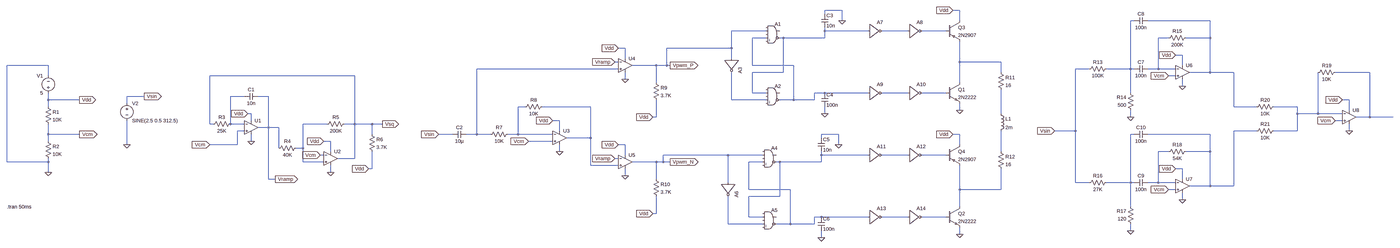
[diagram p0: schematic BANDPASS FILTER.asc, whole sheet]
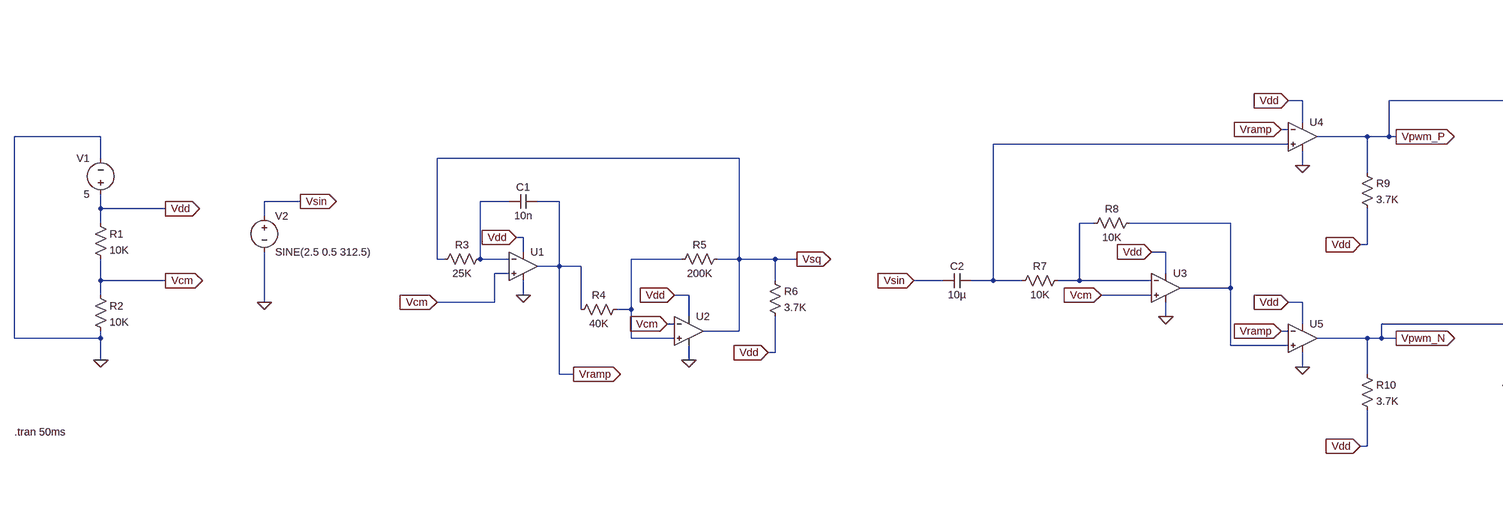
[diagram p1: schematic BANDPASS FILTER.asc, part, row 1 of 1, column 1 of 2]
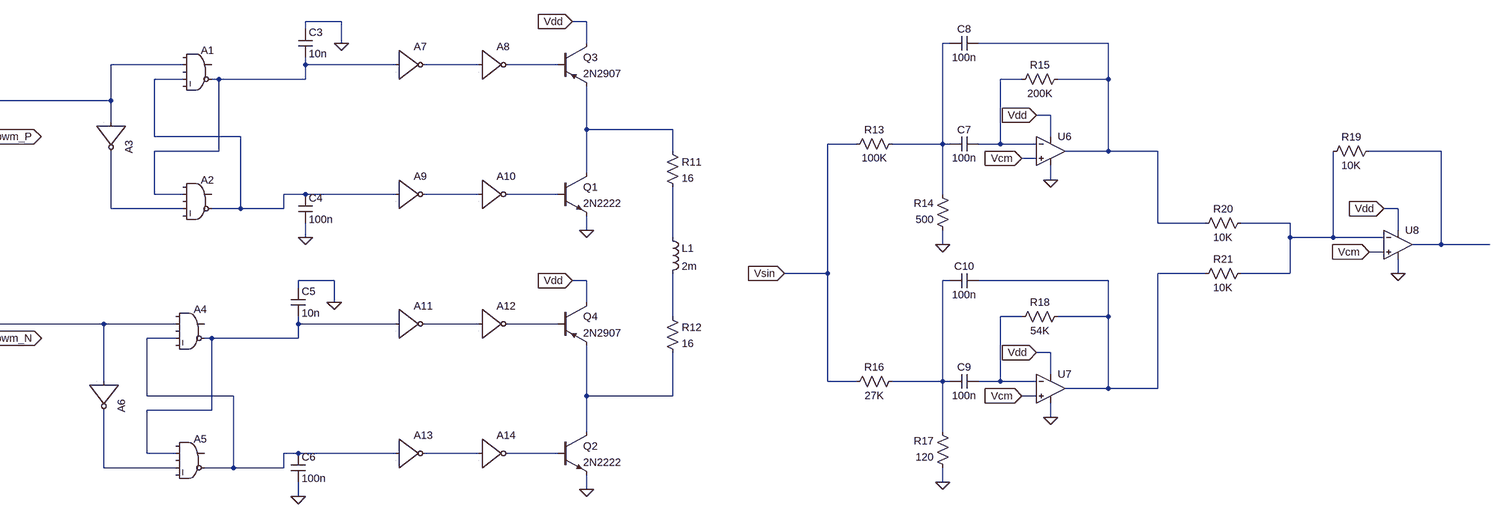
[diagram p2: schematic BANDPASS FILTER.asc, part, row 1 of 1, column 2 of 2]
BANDPASS FILTER.asc, the LTspice schematic file:
Version 4.1
SHEET 1 4436 680
WIRE 1072 -688 992 -688
WIRE 1824 -688 1792 -688
WIRE 992 -672 992 -688
WIRE 1072 -640 1072 -688
WIRE 1824 -640 1824 -688
WIRE 2960 -640 2944 -640
WIRE 3312 -640 3024 -640
WIRE 720 -592 560 -592
WIRE 992 -592 992 -608
WIRE 1296 -592 992 -592
WIRE 1584 -592 1360 -592
WIRE 1760 -592 1648 -592
WIRE 720 -560 656 -560
WIRE 800 -560 784 -560
WIRE 992 -560 992 -592
WIRE 992 -560 800 -560
WIRE 3120 -560 3072 -560
WIRE 3312 -560 3312 -640
WIRE 3312 -560 3200 -560
WIRE -96 -512 -128 -512
WIRE 560 -512 560 -592
WIRE 560 -512 96 -512
WIRE 3184 -480 3152 -480
WIRE -96 -464 -96 -512
WIRE 560 -464 560 -512
WIRE -128 -448 -144 -448
WIRE 1824 -448 1824 -544
WIRE 2112 -448 1824 -448
WIRE -2880 -432 -3072 -432
WIRE 48 -432 -64 -432
WIRE 96 -432 96 -512
WIRE 96 -432 48 -432
WIRE 112 -432 96 -432
WIRE 656 -432 656 -560
WIRE 848 -432 656 -432
WIRE 3184 -432 3184 -480
WIRE -128 -416 -784 -416
WIRE 2752 -416 2688 -416
WIRE 2944 -416 2944 -640
WIRE 2944 -416 2832 -416
WIRE 2960 -416 2944 -416
WIRE 3072 -416 3072 -560
WIRE 3072 -416 3024 -416
WIRE 3152 -416 3072 -416
WIRE 800 -400 800 -560
WIRE 800 -400 656 -400
WIRE 2112 -400 2112 -448
WIRE 3312 -400 3312 -560
WIRE 3312 -400 3216 -400
WIRE 3424 -400 3312 -400
WIRE 4224 -400 4064 -400
WIRE -2880 -384 -2880 -432
WIRE -1392 -384 -2064 -384
WIRE 3152 -384 3120 -384
WIRE -96 -368 -96 -400
WIRE 48 -352 48 -432
WIRE 1824 -352 1824 -448
WIRE 3184 -336 3184 -368
WIRE 656 -304 656 -400
WIRE 720 -304 656 -304
WIRE 992 -304 944 -304
WIRE 1296 -304 992 -304
WIRE 1584 -304 1360 -304
WIRE 1760 -304 1648 -304
WIRE 2944 -304 2944 -416
WIRE -2368 -288 -2448 -288
WIRE -1904 -288 -1968 -288
WIRE -1792 -288 -1840 -288
WIRE -2880 -272 -2880 -304
WIRE -2736 -272 -2880 -272
WIRE 560 -272 560 -400
WIRE 720 -272 560 -272
WIRE 848 -272 848 -432
WIRE 848 -272 784 -272
WIRE 944 -272 944 -304
WIRE 944 -272 848 -272
WIRE 4128 -272 4096 -272
WIRE -2448 -256 -2448 -288
WIRE -2880 -240 -2880 -272
WIRE -560 -240 -592 -240
WIRE -256 -240 -480 -240
WIRE 3424 -240 3424 -400
WIRE 3664 -240 3424 -240
WIRE 3888 -240 3744 -240
WIRE 1824 -224 1824 -256
WIRE 4128 -224 4128 -272
WIRE -1872 -208 -1888 -208
WIRE 992 -208 992 -240
WIRE 2112 -208 2112 -320
WIRE 3888 -208 3888 -240
WIRE 3984 -208 3984 -400
WIRE 3984 -208 3888 -208
WIRE 4096 -208 3984 -208
WIRE 48 -192 48 -272
WIRE 48 -192 32 -192
WIRE 2944 -192 2944 -224
WIRE 4224 -192 4224 -400
WIRE 4224 -192 4160 -192
WIRE 4432 -192 4224 -192
WIRE -1872 -176 -1872 -208
WIRE -400 -176 -432 -176
WIRE 4096 -176 4064 -176
WIRE -2064 -160 -2064 -384
WIRE -2048 -160 -2064 -160
WIRE -1968 -160 -1968 -288
WIRE -1904 -160 -1968 -160
WIRE -1520 -160 -1632 -160
WIRE -1392 -160 -1392 -384
WIRE -1392 -160 -1440 -160
WIRE -1312 -160 -1392 -160
WIRE -1264 -160 -1312 -160
WIRE -1792 -144 -1792 -288
WIRE -1792 -144 -1840 -144
WIRE -1744 -144 -1792 -144
WIRE -1904 -128 -1936 -128
WIRE -400 -128 -400 -176
WIRE 2688 -128 2688 -416
WIRE 2688 -128 2592 -128
WIRE 3664 -128 3424 -128
WIRE 3888 -128 3888 -208
WIRE 3888 -128 3744 -128
WIRE 4128 -128 4128 -160
WIRE -2880 -112 -2880 -160
WIRE -2736 -112 -2880 -112
WIRE -1312 -112 -1312 -160
WIRE -896 -112 -960 -112
WIRE -784 -112 -784 -416
WIRE -784 -112 -832 -112
WIRE -720 -112 -784 -112
WIRE -592 -112 -592 -240
WIRE -592 -112 -640 -112
WIRE -432 -112 -592 -112
WIRE 1056 -112 976 -112
WIRE 1824 -112 1792 -112
WIRE 2960 -112 2944 -112
WIRE 3312 -112 3024 -112
WIRE -256 -96 -256 -240
WIRE -256 -96 -368 -96
WIRE 976 -96 976 -112
WIRE -2880 -80 -2880 -112
WIRE -1872 -80 -1872 -112
WIRE -1504 -80 -1536 -80
WIRE -432 -80 -544 -80
WIRE -2448 -64 -2448 -176
WIRE -1936 -64 -1936 -128
WIRE -1936 -64 -2064 -64
WIRE -96 -64 -128 -64
WIRE 1056 -64 1056 -112
WIRE 1824 -64 1824 -112
WIRE -1744 -48 -1744 -144
WIRE -1632 -48 -1632 -160
WIRE -1632 -48 -1664 -48
WIRE -1504 -32 -1504 -80
WIRE -400 -32 -400 -64
WIRE 2112 -32 2112 -128
WIRE 3120 -32 3072 -32
WIRE 3312 -32 3312 -112
WIRE 3312 -32 3200 -32
WIRE -1536 -16 -1552 -16
WIRE -96 -16 -96 -64
WIRE 544 -16 80 -16
WIRE 704 -16 544 -16
WIRE 976 -16 976 -32
WIRE 1296 -16 976 -16
WIRE 1584 -16 1360 -16
WIRE 1760 -16 1648 -16
WIRE -1392 0 -1392 -160
WIRE -1392 0 -1472 0
WIRE -128 0 -144 0
WIRE -3072 16 -3072 -432
WIRE -2880 16 -2880 0
WIRE -2880 16 -3072 16
WIRE -1632 16 -1632 -48
WIRE -1536 16 -1632 16
WIRE 48 16 -64 16
WIRE 80 16 80 -16
WIRE 80 16 48 16
WIRE 112 16 80 16
WIRE 704 16 640 16
WIRE 784 16 768 16
WIRE 976 16 976 -16
WIRE 976 16 784 16
WIRE -256 32 -256 -96
WIRE -128 32 -256 32
WIRE -1312 48 -1312 -32
WIRE -1312 48 -1328 48
WIRE 3184 48 3152 48
WIRE -2880 64 -2880 16
WIRE -1504 64 -1504 32
WIRE -96 80 -96 48
WIRE -1792 96 -1792 -144
WIRE -1760 96 -1792 96
WIRE 48 96 48 16
WIRE 3184 96 3184 48
WIRE 544 112 544 -16
WIRE 2688 112 2688 -128
WIRE 2752 112 2688 112
WIRE 2944 112 2944 -112
WIRE 2944 112 2832 112
WIRE 2960 112 2944 112
WIRE 3072 112 3072 -32
WIRE 3072 112 3024 112
WIRE 3152 112 3072 112
WIRE 3312 128 3312 -32
WIRE 3312 128 3216 128
WIRE 3424 128 3424 -128
WIRE 3424 128 3312 128
WIRE 640 144 640 16
WIRE 832 144 640 144
WIRE 1824 144 1824 32
WIRE 2112 144 2112 48
WIRE 2112 144 1824 144
WIRE 3152 144 3120 144
WIRE 784 176 784 16
WIRE 784 176 640 176
WIRE 3184 192 3184 160
WIRE 1824 224 1824 144
WIRE 2944 224 2944 112
WIRE 48 256 48 176
WIRE 48 256 32 256
WIRE 640 272 640 176
WIRE 704 272 640 272
WIRE 976 272 944 272
WIRE 1296 272 976 272
WIRE 1584 272 1360 272
WIRE 1760 272 1648 272
WIRE 544 304 544 176
WIRE 704 304 544 304
WIRE 832 304 832 144
WIRE 832 304 768 304
WIRE 944 304 944 272
WIRE 944 304 832 304
WIRE 2944 336 2944 304
WIRE 1824 352 1824 320
WIRE 976 368 976 336
FLAG -2880 64 0
FLAG -2736 -112 Vcm
IOPIN -2736 -112 Out
FLAG -2736 -272 Vdd
IOPIN -2736 -272 Out
FLAG -2064 -64 Vcm
IOPIN -2064 -64 In
FLAG -1888 -208 Vdd
IOPIN -1888 -208 In
FLAG -1536 -80 Vdd
IOPIN -1536 -80 In
FLAG -1872 -80 0
FLAG -1504 64 0
FLAG -1552 -16 Vcm
IOPIN -1552 -16 In
FLAG -1760 96 Vramp
IOPIN -1760 96 Out
FLAG -1264 -160 Vsq
IOPIN -1264 -160 Out
FLAG -1328 48 Vdd
IOPIN -1328 48 In
FLAG -432 -176 Vdd
IOPIN -432 -176 In
FLAG -400 -32 0
FLAG -544 -80 Vcm
IOPIN -544 -80 In
FLAG -960 -112 Vsin
IOPIN -960 -112 In
FLAG -2448 -64 0
FLAG -2368 -288 Vsin
IOPIN -2368 -288 Out
FLAG -128 -512 Vdd
IOPIN -128 -512 In
FLAG -96 -368 0
FLAG -144 -448 Vramp
IOPIN -144 -448 In
FLAG -128 -64 Vdd
IOPIN -128 -64 In
FLAG -96 80 0
FLAG -144 0 Vramp
IOPIN -144 0 In
FLAG 112 -432 Vpwm_P
IOPIN 112 -432 Out
FLAG 112 16 Vpwm_N
IOPIN 112 16 Out
FLAG 32 -192 Vdd
IOPIN 32 -192 In
FLAG 32 256 Vdd
IOPIN 32 256 In
FLAG 1072 -640 0
FLAG 992 -208 0
FLAG 1056 -64 0
FLAG 976 368 0
FLAG 1824 -224 0
FLAG 1824 352 0
FLAG 1792 -688 Vdd
IOPIN 1792 -688 In
FLAG 1792 -112 Vdd
IOPIN 1792 -112 In
FLAG 3152 -480 Vdd
IOPIN 3152 -480 In
FLAG 3184 -336 0
FLAG 2944 -192 0
FLAG 3152 48 Vdd
IOPIN 3152 48 In
FLAG 3184 192 0
FLAG 2944 336 0
FLAG 4096 -272 Vdd
IOPIN 4096 -272 In
FLAG 4128 -128 0
FLAG 3120 -384 Vcm
IOPIN 3120 -384 In
FLAG 3120 144 Vcm
IOPIN 3120 144 In
FLAG 4064 -176 Vcm
IOPIN 4064 -176 In
FLAG 2592 -128 Vsin
IOPIN 2592 -128 In
SYMBOL res -2896 -256 R0
SYMATTR InstName R1
SYMATTR Value 10K
SYMBOL res -2896 -96 R0
SYMATTR InstName R2
SYMATTR Value 10K
SYMBOL OpAmps\\UniversalOpAmp1 -1872 -144 R0
SYMATTR InstName U1
SYMBOL res -1952 -176 R90
WINDOW 0 0 56 VBottom 2
WINDOW 3 32 56 VTop 2
SYMATTR InstName R3
SYMATTR Value 25K
SYMBOL voltage -2880 -288 R180
WINDOW 0 24 96 Left 2
WINDOW 3 24 16 Left 2
WINDOW 123 0 0 Left 0
WINDOW 39 0 0 Left 0
SYMATTR InstName V1
SYMATTR Value 5
SYMBOL OpAmps\\UniversalOpAmp2 -1504 0 R0
SYMATTR InstName U2
SYMBOL res -1648 -64 R90
WINDOW 0 0 56 VBottom 2
WINDOW 3 32 56 VTop 2
SYMATTR InstName R4
SYMATTR Value 40K
SYMBOL res -1424 -176 R90
WINDOW 0 0 56 VBottom 2
WINDOW 3 32 56 VTop 2
SYMATTR InstName R5
SYMATTR Value 200K
SYMBOL cap -1840 -304 R90
WINDOW 0 0 32 VBottom 2
WINDOW 3 32 32 VTop 2
SYMATTR InstName C1
SYMATTR Value 10n
SYMBOL res -1328 -128 R0
SYMATTR InstName R6
SYMATTR Value 3.7K
SYMBOL OpAmps\\UniversalOpAmp2 -400 -96 R0
SYMATTR InstName U3
SYMBOL res -624 -128 R90
WINDOW 0 0 56 VBottom 2
WINDOW 3 32 56 VTop 2
SYMATTR InstName R7
SYMATTR Value 10K
SYMBOL res -464 -256 R90
WINDOW 0 0 56 VBottom 2
WINDOW 3 32 56 VTop 2
SYMATTR InstName R8
SYMATTR Value 10K
SYMBOL cap -896 -128 M90
WINDOW 0 0 32 VBottom 2
WINDOW 3 32 32 VTop 2
SYMATTR InstName C2
SYMATTR Value 10µ
SYMATTR SpiceLine Irms=0
SYMBOL voltage -2448 -272 R0
WINDOW 123 0 0 Left 0
WINDOW 39 0 0 Left 0
SYMATTR InstName V2
SYMATTR Value SINE(2.5 0.5 312.5)
SYMBOL OpAmps\\UniversalOpAmp2 -96 -432 R0
SYMATTR InstName U4
SYMBOL OpAmps\\UniversalOpAmp2 -96 16 R0
SYMATTR InstName U5
SYMBOL res 32 -368 R0
SYMATTR InstName R9
SYMATTR Value 3.7K
SYMBOL res 32 80 R0
SYMATTR InstName R10
SYMATTR Value 3.7K
SYMBOL Digital\\and 752 -640 R0
SYMATTR InstName A1
SYMBOL Digital\\and 752 -352 R0
SYMATTR InstName A2
SYMBOL Digital\\inv 624 -464 R90
SYMATTR InstName A3
SYMBOL cap 976 -672 R0
SYMATTR InstName C3
SYMATTR Value 10n
SYMBOL cap 976 -304 R0
SYMATTR InstName C4
SYMATTR Value 100n
SYMBOL Digital\\and 736 -64 R0
SYMATTR InstName A4
SYMBOL Digital\\and 736 224 R0
SYMATTR InstName A5
SYMBOL Digital\\inv 608 112 R90
SYMATTR InstName A6
SYMBOL cap 960 -96 R0
SYMATTR InstName C5
SYMATTR Value 10n
SYMBOL cap 960 272 R0
SYMATTR InstName C6
SYMATTR Value 100n
SYMBOL Digital\\inv 1296 -656 R0
SYMATTR InstName A7
SYMBOL Digital\\inv 1584 -656 R0
SYMATTR InstName A8
SYMBOL Digital\\inv 1296 -368 R0
SYMATTR InstName A9
SYMBOL Digital\\inv 1584 -368 R0
SYMATTR InstName A10
SYMBOL npn 1760 -352 R0
SYMATTR InstName Q1
SYMATTR Value 2N2222
SYMBOL res 2096 -416 R0
SYMATTR InstName R11
SYMATTR Value 16
SYMBOL res 2096 -48 R0
SYMATTR InstName R12
SYMATTR Value 16
SYMBOL ind 2096 -224 R0
SYMATTR InstName L1
SYMATTR Value 2m
SYMATTR SpiceLine Rser=1m
SYMBOL Digital\\inv 1296 -80 R0
SYMATTR InstName A11
SYMBOL Digital\\inv 1584 -80 R0
SYMATTR InstName A12
SYMBOL Digital\\inv 1296 208 R0
SYMATTR InstName A13
SYMBOL Digital\\inv 1584 208 R0
SYMATTR InstName A14
SYMBOL npn 1760 224 R0
SYMATTR InstName Q2
SYMATTR Value 2N2222
SYMBOL pnp 1760 -640 R0
SYMATTR InstName Q3
SYMATTR Value 2N2907
SYMBOL pnp 1760 -64 R0
SYMATTR InstName Q4
SYMATTR Value 2N2907
SYMBOL OpAmps\\UniversalOpAmp2 3184 -400 R0
SYMATTR InstName U6
SYMBOL res 2848 -432 R90
WINDOW 0 0 56 VBottom 2
WINDOW 3 32 56 VTop 2
SYMATTR InstName R13
SYMATTR Value 100K
SYMBOL res 2960 -208 R180
WINDOW 0 36 76 Left 2
WINDOW 3 36 40 Left 2
SYMATTR InstName R14
SYMATTR Value 500
SYMBOL res 3104 -544 R270
WINDOW 0 32 56 VTop 2
WINDOW 3 0 56 VBottom 2
SYMATTR InstName R15
SYMATTR Value 200K
SYMBOL cap 3024 -432 R90
WINDOW 0 0 32 VBottom 2
WINDOW 3 32 32 VTop 2
SYMATTR InstName C7
SYMATTR Value 100n
SYMBOL cap 3024 -656 R90
WINDOW 0 0 32 VBottom 2
WINDOW 3 32 32 VTop 2
SYMATTR InstName C8
SYMATTR Value 100n
SYMBOL OpAmps\\UniversalOpAmp2 3184 128 R0
SYMATTR InstName U7
SYMBOL res 2848 96 R90
WINDOW 0 0 56 VBottom 2
WINDOW 3 32 56 VTop 2
SYMATTR InstName R16
SYMATTR Value 27K
SYMBOL res 2960 320 R180
WINDOW 0 36 76 Left 2
WINDOW 3 36 40 Left 2
SYMATTR InstName R17
SYMATTR Value 120
SYMBOL res 3104 -16 R270
WINDOW 0 32 56 VTop 2
WINDOW 3 0 56 VBottom 2
SYMATTR InstName R18
SYMATTR Value 54K
SYMBOL cap 3024 96 R90
WINDOW 0 0 32 VBottom 2
WINDOW 3 32 32 VTop 2
SYMATTR InstName C9
SYMATTR Value 100n
SYMBOL cap 3024 -128 R90
WINDOW 0 0 32 VBottom 2
WINDOW 3 32 32 VTop 2
SYMATTR InstName C10
SYMATTR Value 100n
SYMBOL OpAmps\\UniversalOpAmp2 4128 -192 R0
SYMATTR InstName U8
SYMBOL res 4080 -416 R90
WINDOW 0 0 56 VBottom 2
WINDOW 3 32 56 VTop 2
SYMATTR InstName R19
SYMATTR Value 10K
SYMBOL res 3760 -256 R90
WINDOW 0 0 56 VBottom 2
WINDOW 3 32 56 VTop 2
SYMATTR InstName R20
SYMATTR Value 10K
SYMBOL res 3760 -144 R90
WINDOW 0 0 56 VBottom 2
WINDOW 3 32 56 VTop 2
SYMATTR InstName R21
SYMATTR Value 10K
TEXT -3072 224 Left 2 !.tran 50ms

The netlist it stands for:
* BANDPASS FILTER.asc
R1 Vdd Vcm 10K
R2 Vcm 0 10K
X§U1 Vcm N013 Vdd 0 Vramp level1 Avol=1Meg GBW=10Meg Vos=0 En=0 Enk=0 In=0 Ink=0 Rin=500Meg  ; pins In+ In- V+ V- OUT
R3 N013 Vsq 25K
V1 Vdd 0 5
X§U2 N019 Vcm Vdd 0 Vsq level2 Avol=1Meg GBW=10Meg Slew=10Meg Ilimit=25m Rail=0 Vos=0 En=0 Enk=0 In=0 Ink=0 Rin=500Meg  ; pins In+ In- V+ V- OUT
R4 N019 Vramp 40K
R5 Vsq N019 200K
C1 Vramp N013 10n
R6 Vsq Vdd 3.7K
X§U3 Vcm N015 Vdd 0 N016 level2 Avol=1Meg GBW=10Meg Slew=10Meg Ilimit=25m Rail=0 Vos=0 En=0 Enk=0 In=0 Ink=0 Rin=500Meg  ; pins In+ In- V+ V- OUT
R7 N015 N009 10K
R8 N016 N015 10K
C2 Vsin N009 10µ Irms=0
V2 Vsin 0 SINE(2.5 0.5 312.5)
X§U4 N009 Vramp Vdd 0 Vpwm_P level2 Avol=1Meg GBW=10Meg Slew=10Meg Ilimit=25m Rail=0 Vos=0 En=0 Enk=0 In=0 Ink=0 Rin=500Meg  ; pins In+ In- V+ V- OUT
X§U5 N016 Vramp Vdd 0 Vpwm_N level2 Avol=1Meg GBW=10Meg Slew=10Meg Ilimit=25m Rail=0 Vos=0 En=0 Enk=0 In=0 Ink=0 Rin=500Meg  ; pins In+ In- V+ V- OUT
R9 Vpwm_P Vdd 3.7K
R10 Vpwm_N Vdd 3.7K
A1 0 Vpwm_P 0 N006 0 N003 0 0 AND
A2 0 N003 0 N014 0 N006 0 0 AND
A3 Vpwm_P 0 0 0 0 N014 0 0 BUF
C3 0 N003 10n
C4 N006 0 100n
A4 0 Vpwm_N 0 N027 0 N024 0 0 AND
A5 0 N024 0 N031 0 N027 0 0 AND
A6 Vpwm_N 0 0 0 0 N031 0 0 BUF
C5 0 N024 10n
C6 N027 0 100n
A7 N003 0 0 0 0 N004 0 0 BUF
A8 N004 0 0 0 0 N005 0 0 BUF
A9 N006 0 0 0 0 N011 0 0 BUF
A10 N011 0 0 0 0 N012 0 0 BUF
Q1 N008 N012 0 0 2N2222
R11 N008 N018 16
R12 N022 N028 16
L1 N018 N022 2m Rser=1m
A11 N024 0 0 0 0 N025 0 0 BUF
A12 N025 0 0 0 0 N026 0 0 BUF
A13 N027 0 0 0 0 N029 0 0 BUF
A14 N029 0 0 0 0 N030 0 0 BUF
Q2 N028 N030 0 0 2N2222
Q3 Vdd N005 N008 0 2N2907
Q4 Vdd N026 N028 0 2N2907
X§U6 Vcm N007 Vdd 0 N002 level2 Avol=1Meg GBW=10Meg Slew=10Meg Ilimit=25m Rail=0 Vos=0 En=0 Enk=0 In=0 Ink=0 Rin=500Meg  ; pins In+ In- V+ V- OUT
R13 N001 Vsin 100K
R14 0 N001 500
R15 N007 N002 200K
C7 N007 N001 100n
C8 N002 N001 100n
X§U7 Vcm N023 Vdd 0 N020 level2 Avol=1Meg GBW=10Meg Slew=10Meg Ilimit=25m Rail=0 Vos=0 En=0 Enk=0 In=0 Ink=0 Rin=500Meg  ; pins In+ In- V+ V- OUT
R16 N021 Vsin 27K
R17 0 N021 120
R18 N023 N020 54K
C9 N023 N021 100n
C10 N020 N021 100n
X§U8 Vcm N017 Vdd 0 N010 level2 Avol=1Meg GBW=10Meg Slew=10Meg Ilimit=25m Rail=0 Vos=0 En=0 Enk=0 In=0 Ink=0 Rin=500Meg  ; pins In+ In- V+ V- OUT
R19 N010 N017 10K
R20 N017 N002 10K
R21 N017 N020 10K
.model NPN NPN
.model PNP PNP
.lib standard.bjt
.tran 50ms
.lib UniversalOpAmp1.lib
.lib UniversalOpAmp2.lib
.backanno
.end